# EAGLE design breakout (EAGLE 7.7.0)

## Sheet 1 of 2
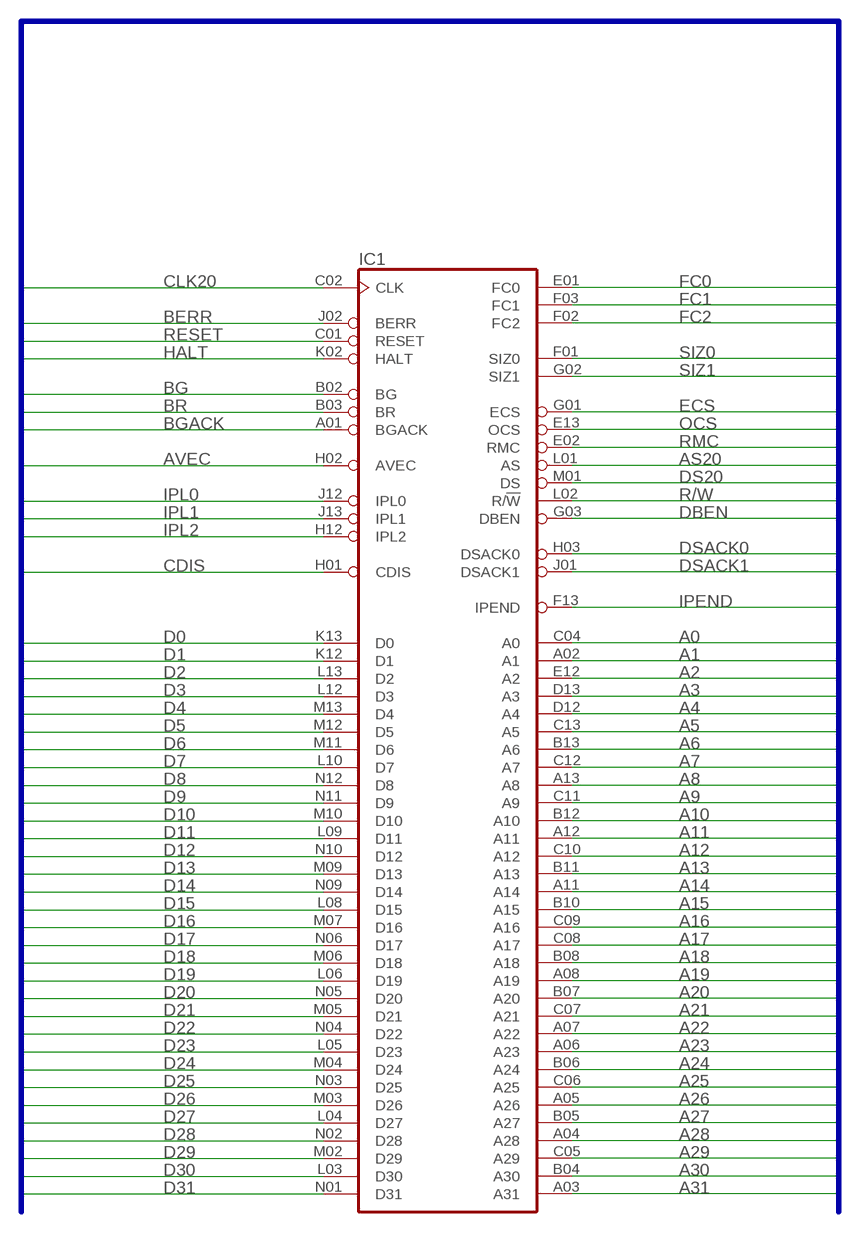
[diagram p0: schematic, sheet 1]

### Parts
IC1  MC68020RC  [MPGA114]

### Nets
A0: IC1.C04(A0) ; also sheet 2
A1: IC1.A02(A1) ; also sheet 2
A2: IC1.E12(A2) ; also sheet 2
A3: IC1.D13(A3) ; also sheet 2
A4: IC1.D12(A4) ; also sheet 2
A5: IC1.C13(A5) ; also sheet 2
A6: IC1.B13(A6) ; also sheet 2
A7: IC1.C12(A7) ; also sheet 2
A8: IC1.A13(A8) ; also sheet 2
A9: IC1.C11(A9) ; also sheet 2
A10: IC1.B12(A10) ; also sheet 2
A11: IC1.A12(A11) ; also sheet 2
A12: IC1.C10(A12) ; also sheet 2
A13: IC1.B11(A13) ; also sheet 2
A14: IC1.A11(A14) ; also sheet 2
A15: IC1.B10(A15) ; also sheet 2
A16: IC1.C09(A16) ; also sheet 2
A17: IC1.C08(A17) ; also sheet 2
A18: IC1.B08(A18) ; also sheet 2
A19: IC1.A08(A19) ; also sheet 2
A20: IC1.B07(A20) ; also sheet 2
A21: IC1.C07(A21) ; also sheet 2
A22: IC1.A07(A22) ; also sheet 2
A23: IC1.A06(A23) ; also sheet 2
A24: IC1.B06(A24) ; also sheet 2
A25: IC1.C06(A25) ; also sheet 2
A26: IC1.A05(A26) ; also sheet 2
A27: IC1.B05(A27) ; also sheet 2
A28: IC1.A04(A28) ; also sheet 2
A29: IC1.C05(A29) ; also sheet 2
A30: IC1.B04(A30) ; also sheet 2
A31: IC1.A03(A31) ; also sheet 2
AS20: IC1.L01(AS) ; also sheet 2
AVEC: IC1.H02(AVEC) ; also sheet 2
BERR: IC1.J02(BERR) ; also sheet 2
BG: IC1.B02(BG)
BGACK: IC1.A01(BGACK) ; also sheet 2
BR: IC1.B03(BR) ; also sheet 2
CDIS: IC1.H01(CDIS) ; also sheet 2
CLK20: IC1.C02(CLK) ; also sheet 2
D0: IC1.K13(D0) ; also sheet 2
D1: IC1.K12(D1) ; also sheet 2
D2: IC1.L13(D2) ; also sheet 2
D3: IC1.L12(D3) ; also sheet 2
D4: IC1.M13(D4) ; also sheet 2
D5: IC1.M12(D5) ; also sheet 2
D6: IC1.M11(D6) ; also sheet 2
D7: IC1.L10(D7) ; also sheet 2
D8: IC1.N12(D8) ; also sheet 2
D9: IC1.N11(D9) ; also sheet 2
D10: IC1.M10(D10) ; also sheet 2
D11: IC1.L09(D11) ; also sheet 2
D12: IC1.N10(D12) ; also sheet 2
D13: IC1.M09(D13) ; also sheet 2
D14: IC1.N09(D14) ; also sheet 2
D15: IC1.L08(D15) ; also sheet 2
D16: IC1.M07(D16) ; also sheet 2
D17: IC1.N06(D17) ; also sheet 2
D18: IC1.M06(D18) ; also sheet 2
D19: IC1.L06(D19) ; also sheet 2
D20: IC1.N05(D20) ; also sheet 2
D21: IC1.M05(D21) ; also sheet 2
D22: IC1.N04(D22) ; also sheet 2
D23: IC1.L05(D23) ; also sheet 2
D24: IC1.M04(D24) ; also sheet 2
D25: IC1.N03(D25) ; also sheet 2
D26: IC1.M03(D26) ; also sheet 2
D27: IC1.L04(D27) ; also sheet 2
D28: IC1.N02(D28) ; also sheet 2
D29: IC1.M02(D29) ; also sheet 2
D30: IC1.L03(D30) ; also sheet 2
D31: IC1.N01(D31) ; also sheet 2
DBEN: IC1.G03(DBEN) ; also sheet 2
DS20: IC1.M01(DS) ; also sheet 2
DSACK0: IC1.H03(DSACK0) ; also sheet 2
DSACK1: IC1.J01(DSACK1) ; also sheet 2
ECS: IC1.G01(ECS) ; also sheet 2
FC0: IC1.E01(FC0) ; also sheet 2
FC1: IC1.F03(FC1) ; also sheet 2
FC2: IC1.F02(FC2) ; also sheet 2
HALT: IC1.K02(HALT) ; also sheet 2
IPEND: IC1.F13(IPEND) ; also sheet 2
IPL0: IC1.J12(IPL0) ; also sheet 2
IPL1: IC1.J13(IPL1) ; also sheet 2
IPL2: IC1.H12(IPL2) ; also sheet 2
OCS: IC1.E13(OCS) ; also sheet 2
R/W: IC1.L02(R/!W) ; also sheet 2
RESET: IC1.C01(RESET) ; also sheet 2
RMC: IC1.E02(RMC) ; also sheet 2
SIZ0: IC1.F01(SIZ0) ; also sheet 2
SIZ1: IC1.G02(SIZ1) ; also sheet 2

### Buses
VCC33,VCC,GND,CLK7M,A[0..31],D[0..31],IPL[0..2],FC[0..2],DSACK[0..1],BR,BGACK,R/W,CLK20,AS20,DS20,BG20,AVEC,SIZ[0..1],DBEN,BERR,RESET,HALT,BG,VPA,VMA,E,AS,UDS,LDS,DTACK,ECS,OCS,RMC,IPEND,CDIS,CIIN,CIIOUT,CBACK,CBREQ,MMUDIS,STATUS,REFILL,STERM

## Sheet 2 of 2
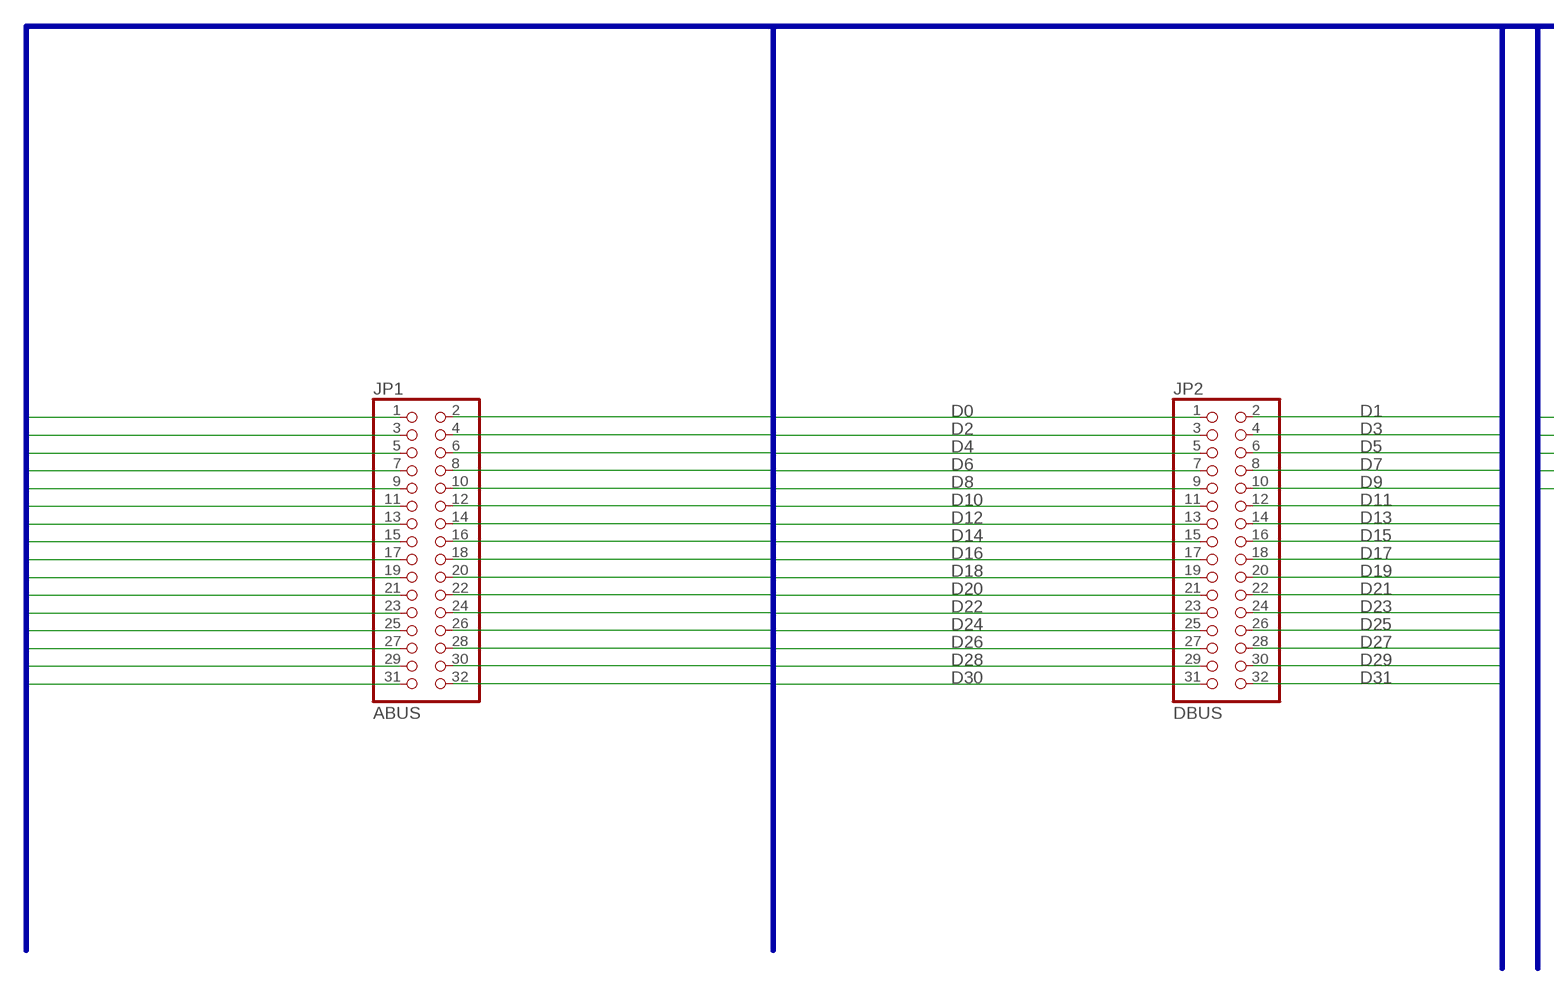
[diagram p1: schematic, sheet 2, part 1 of 2]
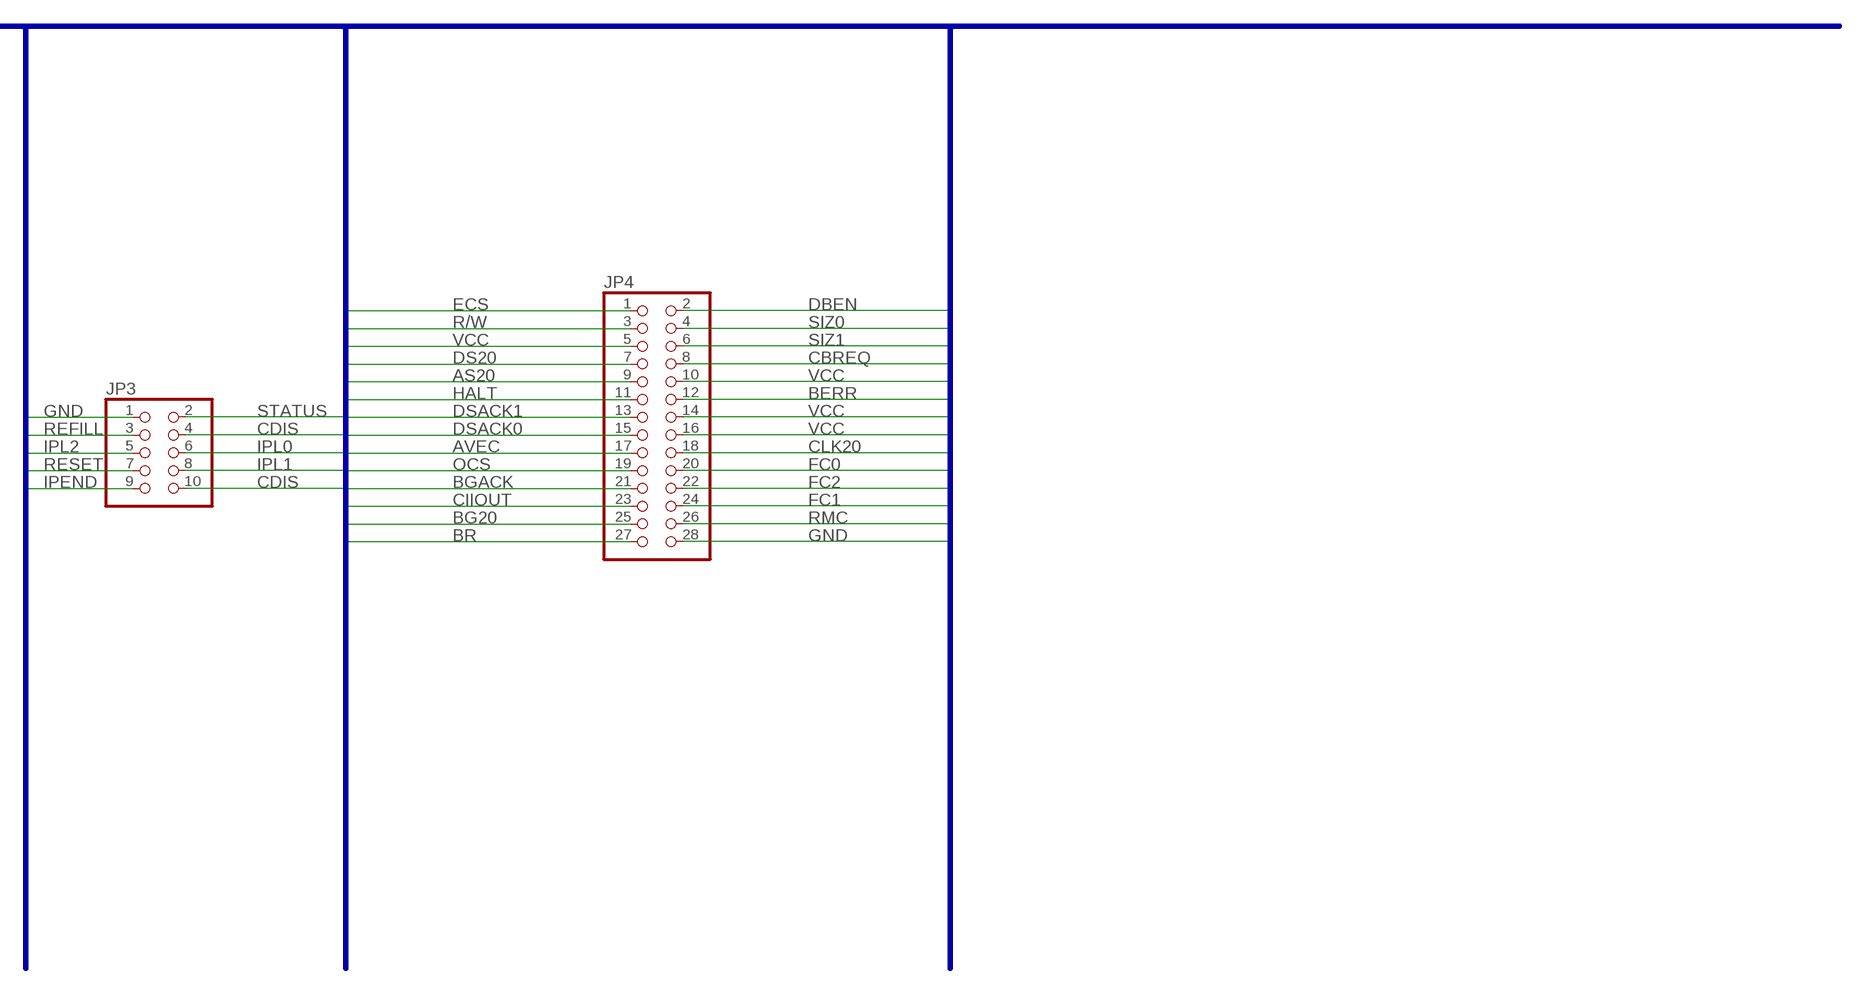
[diagram p2: schematic, sheet 2, part 2 of 2]

### Parts
JP1  ABUS  PINHD-2X16  [2X16]
JP2  DBUS  PINHD-2X16  [2X16]
JP3  PINHD-2X5  [2X05]
JP4  PINHD-2X14  [2X14]

### Nets
A0: JP1.1 ; also sheet 1
A1: JP1.2 ; also sheet 1
A2: JP1.3 ; also sheet 1
A3: JP1.4 ; also sheet 1
A4: JP1.5 ; also sheet 1
A5: JP1.6 ; also sheet 1
A6: JP1.7 ; also sheet 1
A7: JP1.8 ; also sheet 1
A8: JP1.9 ; also sheet 1
A9: JP1.10 ; also sheet 1
A10: JP1.11 ; also sheet 1
A11: JP1.12 ; also sheet 1
A12: JP1.13 ; also sheet 1
A13: JP1.14 ; also sheet 1
A14: JP1.15 ; also sheet 1
A15: JP1.16 ; also sheet 1
A16: JP1.17 ; also sheet 1
A17: JP1.18 ; also sheet 1
A18: JP1.19 ; also sheet 1
A19: JP1.20 ; also sheet 1
A20: JP1.21 ; also sheet 1
A21: JP1.22 ; also sheet 1
A22: JP1.23 ; also sheet 1
A23: JP1.24 ; also sheet 1
A24: JP1.25 ; also sheet 1
A25: JP1.26 ; also sheet 1
A26: JP1.27 ; also sheet 1
A27: JP1.28 ; also sheet 1
A28: JP1.29 ; also sheet 1
A29: JP1.30 ; also sheet 1
A30: JP1.31 ; also sheet 1
A31: JP1.32 ; also sheet 1
AS20: JP4.9 ; also sheet 1
AVEC: JP4.17 ; also sheet 1
BERR: JP4.12 ; also sheet 1
BG20: JP4.25
BGACK: JP4.21 ; also sheet 1
BR: JP4.27 ; also sheet 1
CBREQ: JP4.8
CDIS: JP3.4 JP3.10 ; also sheet 1
CIIOUT: JP4.23
CLK20: JP4.18 ; also sheet 1
D0: JP2.1 ; also sheet 1
D1: JP2.2 ; also sheet 1
D2: JP2.3 ; also sheet 1
D3: JP2.4 ; also sheet 1
D4: JP2.5 ; also sheet 1
D5: JP2.6 ; also sheet 1
D6: JP2.7 ; also sheet 1
D7: JP2.8 ; also sheet 1
D8: JP2.9 ; also sheet 1
D9: JP2.10 ; also sheet 1
D10: JP2.11 ; also sheet 1
D11: JP2.12 ; also sheet 1
D12: JP2.13 ; also sheet 1
D13: JP2.14 ; also sheet 1
D14: JP2.15 ; also sheet 1
D15: JP2.16 ; also sheet 1
D16: JP2.17 ; also sheet 1
D17: JP2.18 ; also sheet 1
D18: JP2.19 ; also sheet 1
D19: JP2.20 ; also sheet 1
D20: JP2.21 ; also sheet 1
D21: JP2.22 ; also sheet 1
D22: JP2.23 ; also sheet 1
D23: JP2.24 ; also sheet 1
D24: JP2.25 ; also sheet 1
D25: JP2.26 ; also sheet 1
D26: JP2.27 ; also sheet 1
D27: JP2.28 ; also sheet 1
D28: JP2.29 ; also sheet 1
D29: JP2.30 ; also sheet 1
D30: JP2.31 ; also sheet 1
D31: JP2.32 ; also sheet 1
DBEN: JP4.2 ; also sheet 1
DS20: JP4.7 ; also sheet 1
DSACK0: JP4.15 ; also sheet 1
DSACK1: JP4.13 ; also sheet 1
ECS: JP4.1 ; also sheet 1
FC0: JP4.20 ; also sheet 1
FC1: JP4.24 ; also sheet 1
FC2: JP4.22 ; also sheet 1
GND: JP3.1 JP4.28
HALT: JP4.11 ; also sheet 1
IPEND: JP3.9 ; also sheet 1
IPL0: JP3.6 ; also sheet 1
IPL1: JP3.8 ; also sheet 1
IPL2: JP3.5 ; also sheet 1
OCS: JP4.19 ; also sheet 1
R/W: JP4.3 ; also sheet 1
REFILL: JP3.3
RESET: JP3.7 ; also sheet 1
RMC: JP4.26 ; also sheet 1
SIZ0: JP4.4 ; also sheet 1
SIZ1: JP4.6 ; also sheet 1
STATUS: JP3.2
VCC: JP4.5 JP4.10 JP4.14 JP4.16

### Buses
VCC33,VCC,GND,CLK7M,A[0..31],D[0..31],IPL[0..2],FC[0..2],DSACK[0..1],BR,BGACK,R/W,CLK20,AS20,DS20,BG20,AVEC,SIZ[0..1],DBEN,BERR,RESET,HALT,BG,VPA,VMA,E,AS,UDS,LDS,DTACK,ECS,OCS,RMC,IPEND,CDIS,CIIN,CIIOUT,CBACK,CBREQ,MMUDIS,STATUS,REFILL,STERM

## Power pins joined to a net without a drawn wire
GND: IC1.A10(GND) IC1.B01(GND) IC1.B09(GND) IC1.C03(GND) IC1.F12(GND) IC1.G12(GND) IC1.H13(GND) IC1.J03(GND) IC1.K01(GND) IC1.K03(GND) IC1.L07(GND) IC1.L11(GND) IC1.N07(GND)
VCC: IC1.A09(VCC) IC1.D01(VCC) IC1.D02(VCC) IC1.D03(VCC) IC1.E03(VCC) IC1.G11(VCC) IC1.G13(VCC) IC1.M08(VCC) IC1.N08(VCC) IC1.N13(VCC)

## Library data of the parts
IC1 = micro-mc68000:MC68020RC: 68xxx PROCESSOR; MF: MOTOROLA; MPN: MC68020RC33E; OC_FARNELL: 1579779; OC_NEWARK: 66F7091
JP1 JP2 = pinhead:PINHD-2X16: PIN HEADER
JP3 = pinhead:PINHD-2X5: PIN HEADER
JP4 = pinhead:PINHD-2X14: PIN HEADER

## Board
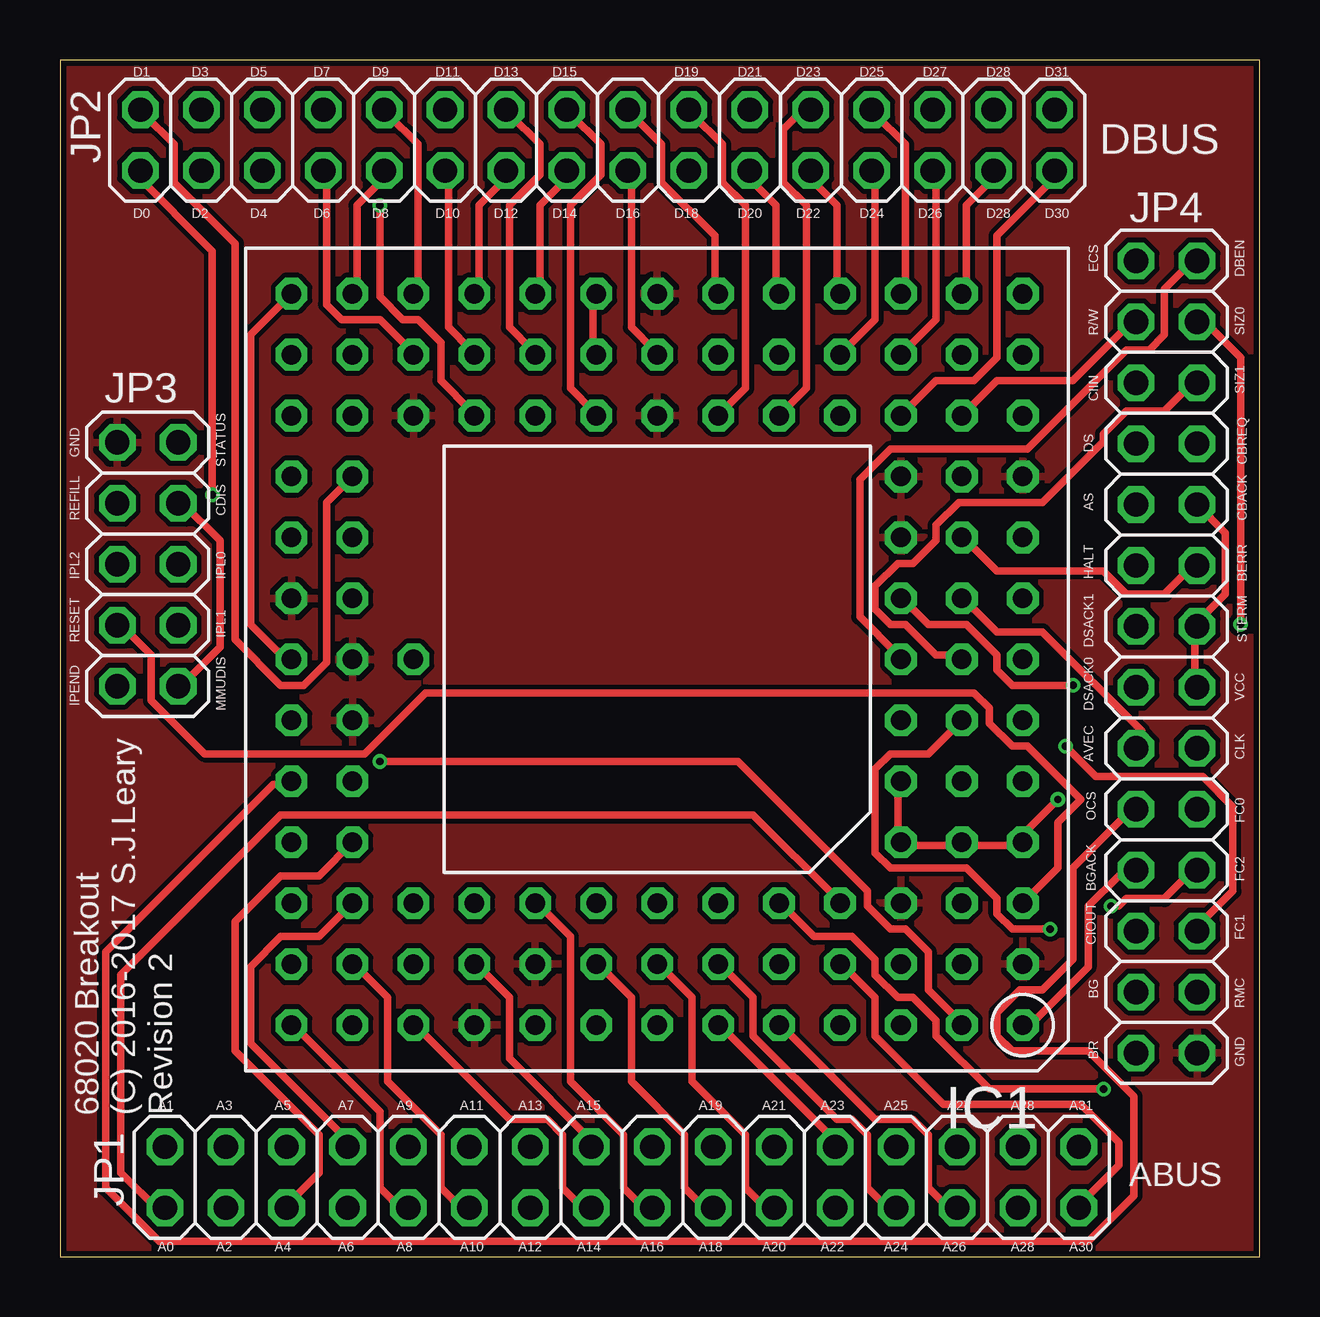
[diagram p3: board, top side]
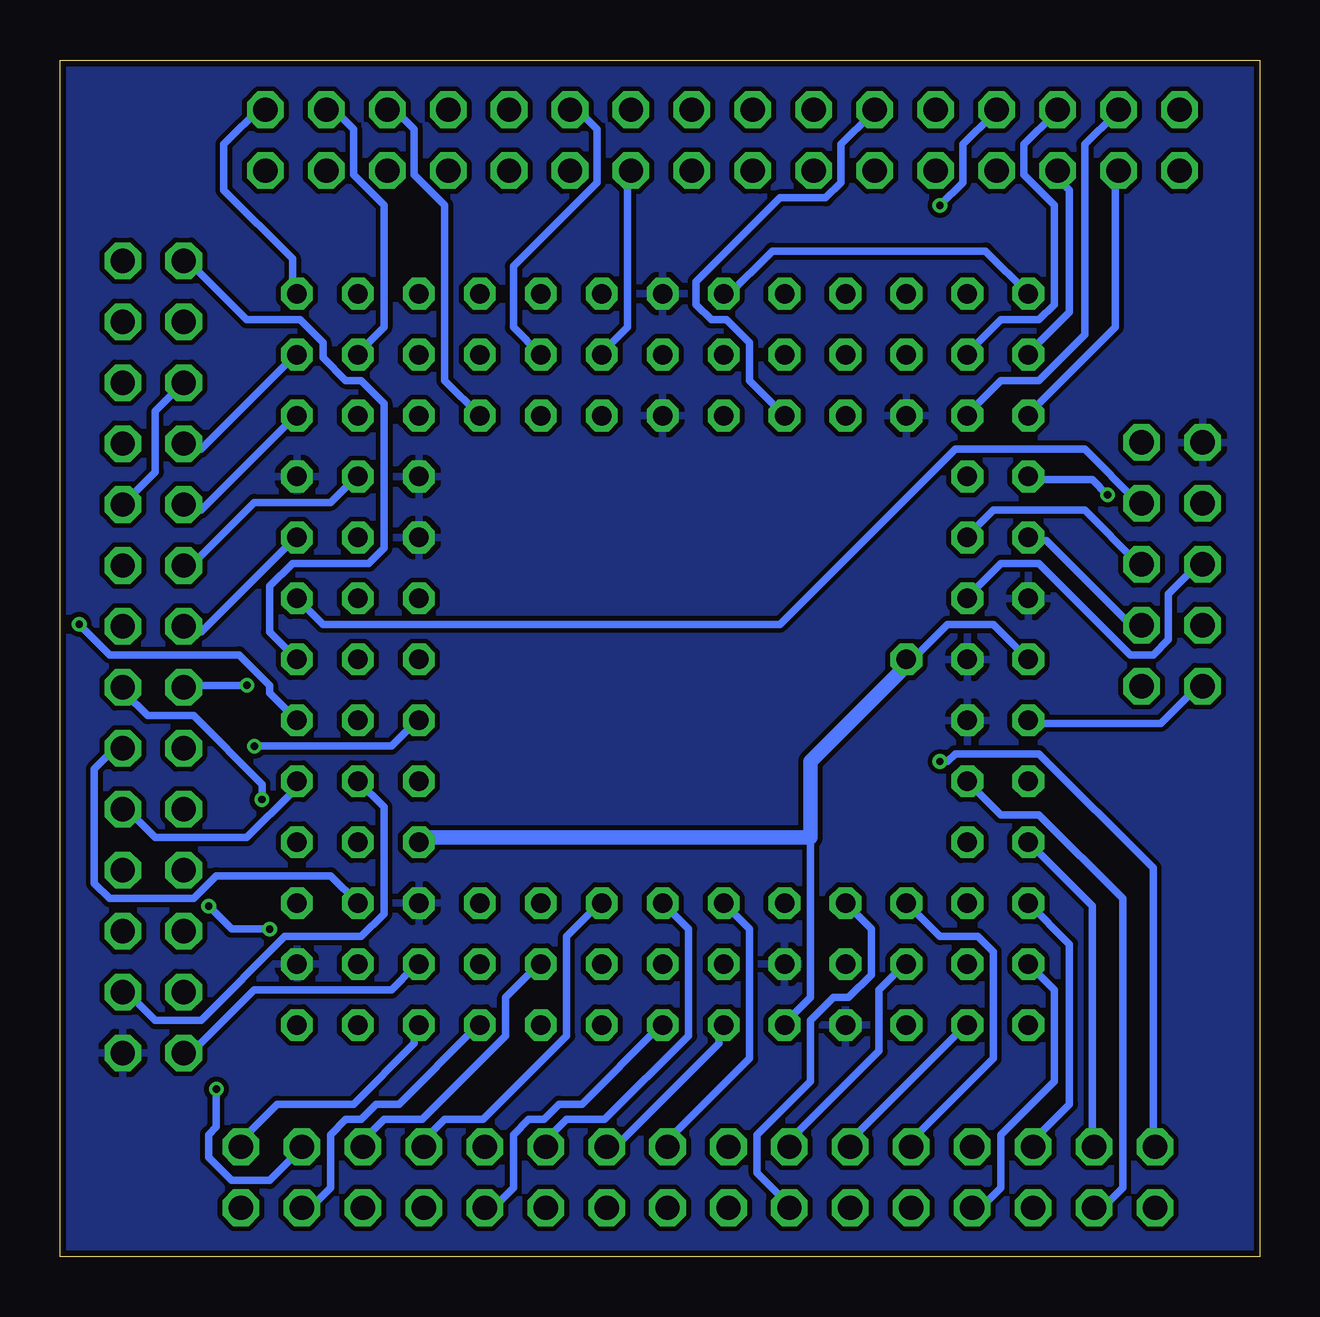
[diagram p4: board, bottom side, seen from below]

Size 50.01 x 49.88 mm. Coordinates in mm from the lower left corner, seen from the top.
Outline: 0,0 50.01,0 50.01,49.88 0,49.88 0,0
Copper layers (1*16): Top 0.035mm / dielectric 1.5mm / Bottom 0.035mm
Design rules "dirt_cheap_dirty_boards.v1 *": minimum track width 12mil, minimum drill 12mil, track to track 8mil, track to pad 8mil, pad to pad 8mil, via to via 8mil, smd to smd 0mil, copper to edge 10mil, drill to drill 10mil, minimum pad ring 10mil, minimum via ring 6mil, stop-mask expansion 2mil, vias tented up to drill 25mil, thermal gap 10mil

### Footprints (pad centres in the part's own frame; a part is rotated, then mirrored left to right if it is on the bottom)
MPGA114 = drill 0.813 octagon: A01 -15.24,15.24; A02 -12.7,15.24; A03 -10.16,15.24; A04 -7.62,15.24; A05 -5.08,15.24; A06 -2.54,15.24; A07 0,15.24; A08 2.54,15.24; A09 5.08,15.24; A10 7.62,15.24; A11 10.16,15.24; A12 12.7,15.24; A13 15.24,15.24; B01 -15.24,12.7; B02 -12.7,12.7; B03 -10.16,12.7; B04 -7.62,12.7; B05 -5.08,12.7; B06 -2.54,12.7; B07 0,12.7; B08 2.54,12.7; B09 5.08,12.7; B10 7.62,12.7; B11 10.16,12.7; B12 12.7,12.7; B13 15.24,12.7; C01 -15.24,10.16; C02 -12.7,10.16; C03 -10.16,10.16; C04 -7.62,10.16; C05 -5.08,10.16; C06 -2.54,10.16; C07 0,10.16; C08 2.54,10.16; C09 5.08,10.16; C10 7.62,10.16; C11 10.16,10.16; C12 12.7,10.16; C13 15.24,10.16; D01 -15.24,7.62; D02 -12.7,7.62; D03 -10.16,7.62; D12 12.7,7.62; D13 15.24,7.62; E01 -15.24,5.08; E02 -12.7,5.08; E03 -10.16,5.08; E12 12.7,5.08; E13 15.24,5.08; F01 -15.24,2.54; F02 -12.7,2.54; F03 -10.16,2.54; F12 12.7,2.54; F13 15.24,2.54; G01 -15.24,0; G02 -12.7,0; G03 -10.16,0; G11 10.16,0; G12 12.7,0; G13 15.24,0; H01 -15.24,-2.54; H02 -12.7,-2.54; H03 -10.16,-2.54; H12 12.7,-2.54; H13 15.24,-2.54; J01 -15.24,-5.08; J02 -12.7,-5.08; J03 -10.16,-5.08; J12 12.7,-5.08; J13 15.24,-5.08; K01 -15.24,-7.62; K02 -12.7,-7.62; K03 -10.16,-7.62; K12 12.7,-7.62; K13 15.24,-7.62; L01 -15.24,-10.16; L02 -12.7,-10.16; L03 -10.16,-10.16; L04 -7.62,-10.16; L05 -5.08,-10.16; L06 -2.54,-10.16; L07 0,-10.16; L08 2.54,-10.16; L09 5.08,-10.16; L10 7.62,-10.16; L11 10.16,-10.16; L12 12.7,-10.16; L13 15.24,-10.16; M01 -15.24,-12.7; M02 -12.7,-12.7; M03 -10.16,-12.7; M04 -7.62,-12.7; M05 -5.08,-12.7; M06 -2.54,-12.7; M07 0,-12.7; M08 2.54,-12.7; M09 5.08,-12.7; M10 7.62,-12.7; M11 10.16,-12.7; M12 12.7,-12.7; M13 15.24,-12.7; N01 -15.24,-15.24; N02 -12.7,-15.24; N03 -10.16,-15.24; N04 -7.62,-15.24; N05 -5.08,-15.24; N06 -2.54,-15.24; N07 0,-15.24; N08 2.54,-15.24; N09 5.08,-15.24; N10 7.62,-15.24; N11 10.16,-15.24; N12 12.7,-15.24; N13 15.24,-15.24
2X16 = drill 1.016 octagon: 1 -19.05,-1.27; 2 -19.05,1.27; 3 -16.51,-1.27; 4 -16.51,1.27; 5 -13.97,-1.27; 6 -13.97,1.27; 7 -11.43,-1.27; 8 -11.43,1.27; 9 -8.89,-1.27; 10 -8.89,1.27; 11 -6.35,-1.27; 12 -6.35,1.27; 13 -3.81,-1.27; 14 -3.81,1.27; 15 -1.27,-1.27; 16 -1.27,1.27; 17 1.27,-1.27; 18 1.27,1.27; 19 3.81,-1.27; 20 3.81,1.27; 21 6.35,-1.27; 22 6.35,1.27; 23 8.89,-1.27; 24 8.89,1.27; 25 11.43,-1.27; 26 11.43,1.27; 27 13.97,-1.27; 28 13.97,1.27; 29 16.51,-1.27; 30 16.51,1.27; 31 19.05,-1.27; 32 19.05,1.27
2X05 = drill 1.016 octagon: 1 -5.08,-1.27; 2 -5.08,1.27; 3 -2.54,-1.27; 4 -2.54,1.27; 5 0,-1.27; 6 0,1.27; 7 2.54,-1.27; 8 2.54,1.27; 9 5.08,-1.27; 10 5.08,1.27
2X14 = drill 1.016 octagon: 1 -16.51,-1.27; 2 -16.51,1.27; 3 -13.97,-1.27; 4 -13.97,1.27; 5 -11.43,-1.27; 6 -11.43,1.27; 7 -8.89,-1.27; 8 -8.89,1.27; 9 -6.35,-1.27; 10 -6.35,1.27; 11 -3.81,-1.27; 12 -3.81,1.27; 13 -1.27,-1.27; 14 -1.27,1.27; 15 1.27,-1.27; 16 1.27,1.27; 17 3.81,-1.27; 18 3.81,1.27; 19 6.35,-1.27; 20 6.35,1.27; 21 8.89,-1.27; 22 8.89,1.27; 23 11.43,-1.27; 24 11.43,1.27; 25 13.97,-1.27; 26 13.97,1.27; 27 16.51,-1.27; 28 16.51,1.27

### Placement (x,y rotation side)
IC1  24.89,24.89 180 top
JP1  23.42,3.3 0 top
JP2  22.4,46.53 0 top
JP3  3.66,28.85 270 top
JP4  46.13,24.99 270 top

### Tracks (layer width: path | path; a pad name or v marks a point on that pad's centre or on a via)
A0
  Top 0.305: IC1.C04 32.38,14.92 28.89,18.41 9.21,18.41 2.54,11.75 2.54,3.49 4.13,1.91 JP1.1
A1  (via drill 0.3)
  Top 0.305: v13.34,20.64 28.26,20.64 33.66,15.24 33.66,14.61 34.61,13.65 35.24,13.65 36.2,12.7 36.2,11.11 37.47,9.84 IC1.A02
  Bottom 0.305: v13.34,20.64 13.02,20.64 12.7,20.95 9.21,20.95 4.45,16.19 4.45,4.76 JP1.2
A2
  Bottom 0.305: IC1.E12 10.79,18.41 9.21,18.41 5.71,14.92 5.71,2.86 6.67,1.91 JP1.3
A3
  Bottom 0.305: IC1.D13 6.99,14.61 6.99,4.76 JP1.4
A4
  Top 0.305: IC1.D12 10.79,15.88 9.21,15.88 7.3,13.97 7.3,8.57 10.79,5.08 10.79,3.49 9.53,2.22 JP1.5
A5
  Bottom 0.305: IC1.C13 7.94,13.02 7.94,6.35 9.53,4.76 JP1.6
A6
  Bottom 0.305: IC1.B13 8.57,11.11 8.57,7.3 10.79,5.08 10.79,2.86 11.75,1.91 JP1.7
A7
  Top 0.305: IC1.C12 10.79,13.34 9.21,13.34 7.94,12.06 7.94,8.89 12.06,4.76 JP1.8
A8
  Top 0.305: IC1.A13 9.84,9.53 13.34,6.03 13.34,2.86 14.29,1.91 JP1.9
A9
  Bottom 0.305: IC1.C11 13.34,13.34 11.75,13.34 11.11,12.7 11.11,8.26 14.61,4.76 JP1.10
A10
  Top 0.305: IC1.B12 12.38,12.06 13.65,10.79 13.65,7.3 15.88,5.08 15.88,2.86 16.83,1.91 JP1.11
A11
  Bottom 0.305: IC1.A12 12.38,9.53 17.14,4.76 JP1.12
A12
  Bottom 0.305: IC1.C10 16.19,13.65 16.19,11.75 17.14,10.79 17.78,10.79 18.73,9.84 18.73,7.3 20.95,5.08 20.95,3.49 19.68,2.22 JP1.13
A13
  Bottom 0.305: IC1.B11 14.92,12.06 15.88,11.11 15.88,8.57 19.68,4.76 JP1.14
A14
  Top 0.305: IC1.A11 14.92,9.53 18.73,5.71 20.32,5.71 20.95,5.08 20.95,2.86 21.91,1.91 JP1.15
A15
  Top 0.305: IC1.B10 17.46,12.06 18.73,10.79 18.73,8.26 22.23,4.76 JP1.16
A16
  Top 0.305: IC1.C09 20,14.61 21.27,13.34 21.27,7.3 23.5,5.08 23.5,2.86 24.45,1.91 JP1.17
A17
  Bottom 0.305: IC1.C08 21.27,13.65 21.27,8.26 24.77,4.76 JP1.18
A18
  Top 0.305: IC1.B08 22.54,12.06 23.81,10.79 23.81,7.3 26.04,5.08 26.04,2.86 26.99,1.91 JP1.19
A19
  Bottom 0.305: IC1.A08 22.54,9.53 22.54,8.89 26.99,4.45 JP1.20
A20
  Top 0.305: IC1.B07 25.08,12.06 26.35,10.79 26.35,7.3 28.57,5.08 28.57,2.86 29.53,1.91 JP1.21
A21
  Bottom 0.305: IC1.C07 23.81,13.65 23.81,9.21 27.3,5.71 28.89,5.71 29.84,4.76 JP1.22
A22
  Bottom 0.305: IC1.A07 25.08,9.53 28.26,6.35 29.21,6.35 29.84,5.71 30.48,5.71 31.11,5.08 31.11,2.86 32.07,1.91 JP1.23
A23
  Top 0.305: IC1.A06 27.62,9.53 32.38,4.76 JP1.24
A24
  Top 0.305: IC1.B06 27.62,12.06 28.89,10.79 28.89,9.21 32.38,5.71 33.02,5.71 33.66,5.08 33.66,2.86 34.61,1.91 JP1.25
A25
  Bottom 0.305: IC1.C06 27.62,14.61 28.89,13.34 28.89,9.21 32.38,5.71 33.97,5.71 34.92,4.76 JP1.26
A26
  Top 0.305: IC1.A05 30.16,9.53 33.97,5.71 35.56,5.71 36.2,5.08 36.2,2.86 37.15,1.91 JP1.27
A27
  Bottom 0.305: IC1.B05 30.16,12.06 31.43,10.79 31.43,9.21 34.92,5.71 36.51,5.71 37.47,4.76 JP1.28
A28
  Bottom 0.305: IC1.A04 32.7,9.53 35.88,6.35 36.83,6.35 37.47,5.71 38.1,5.71 38.73,5.08 38.73,2.86 39.69,1.91 JP1.29
A29  (via drill 0.3)
  Top 0.305: v43.5,6.99 38.73,6.99 36.51,9.21 36.51,9.84 35.56,10.79 34.92,10.79 33.97,11.75 33.97,12.38 33.02,13.34 31.43,13.34 30.16,14.61 IC1.C05
  Bottom 0.305: v43.5,6.99 43.5,5.4 43.81,5.08 43.81,4.13 42.86,3.17 41.27,3.17 40.01,4.45 JP1.30
A30
  Top 0.305: IC1.B04 32.7,12.06 33.97,10.79 33.97,9.21 36.83,6.35 42.55,6.35 44.13,4.76 44.13,3.81 42.55,2.22 JP1.31
A31
  Bottom 0.305: IC1.A03 35.24,9.53 35.24,8.89 37.78,6.35 40.96,6.35 42.55,4.76 JP1.32
AS20
  Bottom 0.305: IC1.L01 40.32,34.92 44.13,31.11 44.77,31.11 JP4.9
AVEC
  Top 0.305: IC1.H02 37.78,27.3 39.05,26.04 40.96,26.04 45.09,21.91 45.09,21.27 JP4.17
BERR
  Top 0.305: IC1.J02 37.78,29.84 39.05,28.57 43.5,28.57 44.45,27.62 46.04,27.62 47.31,28.89 JP4.12
BGACK
  Top 0.305: IC1.A01 40.32,9.84 40.64,9.84 42.86,12.06 42.86,14.61 44.13,15.88 44.77,15.88 JP4.21
BR
  Bottom 0.305: IC1.B03 35.24,12.06 36.2,11.11 41.91,11.11 44.77,8.26 JP4.27
CDIS
  Top 0.305: JP3.10 5.08,23.81 6.67,25.4 6.67,29.84 5.08,31.43 JP3.4
  Bottom 0.305: IC1.H01 39.05,26.35 20,26.35 12.7,33.66 7.3,33.66 5.08,31.43 JP3.4
CLK20
  Bottom 0.305: IC1.C02 38.73,15.88 43.5,15.88 44.45,14.92 47.94,14.92 48.58,15.56 48.58,20.32 47.62,21.27 JP4.18
D0  (via drill 0.3)
  Top 0.305: v6.35,31.75 6.35,41.91 3.17,45.09 JP2.1
  Bottom 0.305: v6.35,31.75 6.99,32.38 9.53,32.38 IC1.K13
D1
  Top 0.305: IC1.K12 11.11,31.43 11.11,24.77 10.16,23.81 9.21,23.81 7.3,25.72 7.3,42.23 4.76,44.77 4.76,46.35 3.49,47.62 JP2.2
D2
  Bottom 0.305: IC1.L13 9.53,35.24 6.03,38.73 6.03,45.09 JP2.3
D3
  Bottom 0.305: IC1.L12 12.06,35.24 10.79,36.51 9.21,36.51 7.3,38.42 7.3,46.35 6.03,47.62 JP2.4
D4
  Bottom 0.305: IC1.M13 9.53,37.78 7.94,39.37 7.94,44.45 8.57,45.09 JP2.5
D5
  Bottom 0.305: IC1.M12 12.06,37.78 10.79,39.05 9.21,39.05 8.57,39.69 8.57,43.81 9.84,45.09 9.84,46.35 8.57,47.62 JP2.6
D6
  Top 0.305: IC1.M11 14.61,37.78 13.34,39.05 11.75,39.05 11.11,39.69 11.11,45.09 JP2.7
D7  (via drill 0.3)
  Top 0.305: v13.34,43.81 13.34,40.01 14.29,39.05 14.92,39.05 15.88,38.1 15.88,36.51 17.14,35.24 IC1.L10
  Bottom 0.305: v13.34,43.81 12.38,44.77 12.38,46.35 11.11,47.62 JP2.8
D8
  Top 0.305: IC1.N12 12.38,40.32 12.38,43.81 13.65,45.09 JP2.9
D9
  Top 0.305: IC1.N11 14.92,40.32 14.92,46.35 13.65,47.62 JP2.10
D10
  Top 0.305: IC1.M10 17.14,37.78 16.19,38.73 16.19,45.09 JP2.11
D11
  Bottom 0.305: IC1.L09 21.27,36.51 21.27,38.1 22.23,39.05 22.86,39.05 23.5,39.69 23.5,40.64 20,44.13 18.1,44.13 17.46,44.77 17.46,46.35 16.19,47.62 JP2.12
D12
  Top 0.305: IC1.N10 17.46,40.32 17.46,43.81 18.73,45.09 JP2.13
D13
  Top 0.305: IC1.M09 19.68,37.78 18.73,38.73 18.73,43.81 20,45.09 20,46.35 18.73,47.62 JP2.14
D14
  Top 0.305: IC1.N09 20,40.32 20,43.81 21.27,45.09 JP2.15
D15
  Top 0.305: IC1.L08 22.23,35.24 21.27,36.2 21.27,43.81 22.54,45.09 22.54,46.35 21.27,47.62 JP2.16
D16
  Top 0.305: IC1.M07 24.77,37.78 23.81,38.73 23.81,45.09 JP2.17
D17
  Top 0.305: IC1.N06 27.3,40.32 27.3,42.55 25.08,44.77 25.08,46.35 23.81,47.62 JP2.18
D18
  Bottom 0.305: IC1.M06 27.3,37.78 26.35,38.73 26.35,45.09 JP2.19
D19
  Top 0.305: IC1.L06 28.57,36.2 28.57,43.81 27.62,44.77 27.62,46.35 26.35,47.62 JP2.20
D20
  Top 0.305: IC1.N05 29.84,40.32 29.84,43.81 28.57,45.09 JP2.21
D21
  Bottom 0.305: IC1.M05 31.11,38.73 31.11,41.27 27.62,44.77 27.62,46.99 28.57,47.94 JP2.22
D22
  Top 0.305: IC1.N04 32.38,40.32 32.38,43.81 31.11,45.09 JP2.23
D23
  Top 0.305: IC1.L05 31.11,36.2 31.11,43.81 30.16,44.77 30.16,46.99 31.11,47.94 JP2.24
D24
  Top 0.305: IC1.M04 33.97,39.05 33.97,45.09 JP2.25
D25
  Top 0.305: IC1.N03 35.24,40.32 35.24,46.35 33.97,47.62 JP2.26
D26
  Top 0.305: IC1.M03 36.51,39.05 36.51,45.09 JP2.27
D27
  Bottom 0.305: IC1.L04 33.97,36.51 33.97,43.81 35.24,45.09 35.24,46.99 36.2,47.94 JP2.28
D28
  Top 0.305: IC1.N02 37.78,40.32 37.78,43.81 39.05,45.09 JP2.29
D29
  Bottom 0.305: IC1.M02 37.47,37.78 36.51,38.73 36.51,43.81 37.78,45.09 37.78,46.99 38.73,47.94 JP2.30
D30
  Top 0.305: IC1.L03 36.51,36.51 38.1,36.51 39.05,37.47 39.05,42.55 41.59,45.09 JP2.31
D31
  Bottom 0.305: IC1.N01 40.32,40.32 40.32,41.59 43.18,44.45 43.18,46.35 41.59,47.94 JP2.32
DBEN
  Top 0.305: IC1.G03 34.92,25.08 33.34,26.67 33.34,32.38 34.61,33.66 40.32,33.66 44.45,37.78 45.4,37.78 46.04,38.42 46.04,40.32 47.31,41.59 JP4.2
DS20
  Bottom 0.305: IC1.M01 40.32,37.47 44.13,33.66 44.77,33.66 JP4.7
DSACK0  (via drill 0.3)
  Top 0.305: v42.23,23.81 39.69,23.81 39.05,24.45 39.05,25.08 37.78,26.35 36.2,26.35 35.24,27.3 IC1.H03
  Bottom 0.305: v42.23,23.81 44.77,23.81 JP4.15
DSACK1
  Bottom 0.305: IC1.J01 40.32,29.84 44.13,26.04 44.77,26.04 JP4.13
ECS
  Bottom 0.305: IC1.G01 41.27,26.04 41.27,27.94 40.32,28.89 37.15,28.89 36.51,29.53 36.51,35.56 37.47,36.51 38.1,36.51 39.05,37.47 39.05,38.1 40.01,39.05 42.23,39.05 44.77,41.59 JP4.1
FC0
  Bottom 0.305: IC1.E01 40.32,19.68 40.32,19.37 42.23,17.46 46.04,17.46 47.31,18.73 JP4.20
FC1  (via drill 0.3)
  Top 0.305: v41.91,21.27 43.18,20 47.62,20 48.9,18.73 48.9,15.24 47.31,13.65 JP4.24
  Bottom 0.305: v41.91,21.27 36.2,21.27 35.24,22.23 IC1.F03
FC2  (via drill 0.3)
  Top 0.305: IC1.F02 36.2,20.95 34.61,20.95 33.97,20.32 33.97,16.83 34.61,16.19 37.78,16.19 39.05,14.92 39.05,14.29 39.69,13.65 v41.27,13.65 | v43.81,14.61 44.13,14.61 44.45,14.92 46.04,14.92 47.31,16.19 JP4.22
  Bottom 0.305: v41.27,13.65 42.86,13.65 v43.81,14.61
GND
  pour Bottom: 0,49.78 49.99,49.78 49.99,0 0,0
  pour Top: 0.1,49.89 50.09,49.89 49.99,0 0,0
HALT
  Bottom 0.305: IC1.K02 37.78,32.38 38.73,31.43 41.91,31.43 44.77,28.57 JP4.11
IPEND
  Bottom 0.305: IC1.F13 9.53,22.23 4.13,22.23 2.54,23.81 JP3.9
IPL0
  Bottom 0.305: IC1.J12 12.06,30.16 11.11,31.11 7.3,31.11 5.08,28.89 JP3.6
IPL1
  Bottom 0.305: IC1.J13 9.53,29.84 8.89,29.84 5.08,26.04 JP3.8
IPL2
  Bottom 0.305: IC1.H12 12.06,27.62 10.79,28.89 9.21,28.89 5.4,25.08 4.45,25.08 3.81,25.72 3.81,27.62 2.54,28.89 JP3.5
OCS
  Top 0.305: IC1.E13 9.53,19.68 8.89,19.68 1.91,12.7 1.91,2.86 4.13,0.64 42.86,0.64 44.77,2.54 44.77,6.67 42.86,8.57 39.69,8.57 39.05,9.21 39.05,10.16 40.01,11.11 40.96,11.11 42.23,12.38 42.23,16.19 44.77,18.73 JP4.19
R/W
  Top 0.305: IC1.L02 39.05,36.51 42.23,36.51 44.77,39.05 JP4.3
RESET
  Top 0.305: IC1.C01 41.59,16.19 41.59,18.1 42.55,19.05 40.32,21.27 39.69,21.27 38.73,22.23 38.73,22.86 38.1,23.5 15.24,23.5 12.7,20.95 6.03,20.95 3.81,23.18 3.81,25.08 2.54,26.35 JP3.7
RMC
  Bottom 0.305: IC1.E02 36.51,18.73 36.51,14.29 37.47,13.34 40.64,13.34 44.13,9.84 46.04,9.84 47.31,11.11 JP4.26
SIZ0  (via drill 0.3)
  Top 0.305: v49.21,26.35 49.21,37.47 47.62,39.05 JP4.4
  Bottom 0.305: IC1.F01 41.27,23.5 41.27,23.81 42.55,25.08 47.94,25.08 v49.21,26.35
SIZ1
  Top 0.305: IC1.G02 37.47,25.08 36.51,25.08 35.24,26.35 34.61,26.35 33.97,26.99 33.97,27.94 34.92,28.89 35.56,28.89 36.51,29.84 36.51,30.48 37.47,31.43 40.96,31.43 43.5,33.97 43.5,34.29 44.45,35.24 46.04,35.24 47.31,36.51 JP4.6
VCC  (via drill 0.3)
  Top 0.305: JP4.16 47.31,23.81 47.31,26.04 JP4.14 47.31,26.35 48.58,27.62 48.58,30.16 JP4.10 | IC1.M08 22.23,37.78 22.23,40.01 IC1.N08 | IC1.E03 34.92,19.68 34.92,17.46 IC1.D03 35.24,17.14 37.47,17.14 IC1.D02 37.78,17.14 40.01,17.14 IC1.D01 40.01,17.46 v41.59,19.05 | IC1.N13 7.94,38.42 7.94,26.35 9.53,24.77 IC1.G13
  Bottom 0.305: JP4.5 46.04,35.24 46.04,32.7 JP4.10 | IC1.N13 11.43,41.91 20.32,41.91 22.23,40.01 IC1.N08 | 18.73,17.46 18.73,10.79 19.68,9.84 IC1.A09 | IC1.G13 11.11,26.35 13.02,26.35 14.61,24.77 IC1.G11 | 34.92,17.46 IC1.D03 | v41.59,19.05 41.59,19.68 44.45,22.54 46.35,22.54 47.31,23.5 JP4.16
  Bottom 0.61: 14.61,24.77 18.73,20.64 18.73,17.46 34.92,17.46

### Text on the board
tNames: D1 | D3 | D5 | D7 | D9 | D11 | D13 | D15 | D19 | D21 | D23 | D25 | D27 | D28 | D31 | D0 | D2 | D4 | D6 | D8 | D10 | D12 | D14 | D16 | D18 | D20 | D22 | D24 | D26 | D28 | D30 | ECS | DBEN | R/W | SIZ0 | CIIN | SIZ1 | DS | GND | STATUS | CBREQ | REFILL | CDIS | AS | CBACK | IPL2 | IPL0 | HALT | BERR | RESET | IPL1 | STERM | DSACK1 | IPEND | MMUDIS | DSACK0 | VCC | AVEC | CLK | OCS | FC0 | FC2 | BGACK | CIOUT | FC1 | BG | RMC | BR | GND | A1 | 68020 Breakout / (C) 2016-2017 S.J.Leary / Revision 2 | A3 | A5 | A7 | A9 | A11 | A13 | A15 | A19 | A21 | A23 | A25 | A27 | A28 | A31 | A0 | A2 | A4 | A6 | A8 | A10 | A12 | A14 | A16 | A18 | A20 | A22 | A24 | A26 | A28 | A30
tValues: D17 | A17